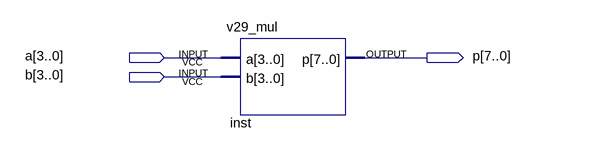
[diagram p0: schematic sheet]
// Quartus schematic vs29_mul.bdf as structural Verilog: 1 symbols, 3 pins
module vs29_mul (
  input  [3:0] a,
  input  [3:0] b,
  output [7:0] p
);

  v29_mul inst (.a(a), .b(b), .p(p));
endmodule
